# Altium schematic sheet inputVac.SchDoc
size 381 x 241 mm
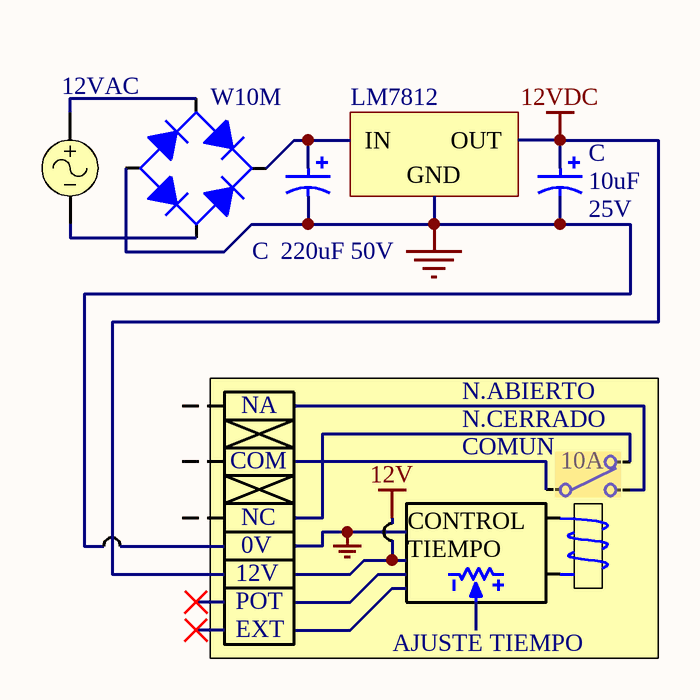
[diagram p0: inputVac.SchDoc]

## Parts
(Parts that share a designator on the sheet are numbered #1, #2 ... from top to bottom, then left to right.)
C#1  value 220uF  Voltaje: 50V  [C_EL_6-3X11]  (hidden comment: Cap Pol)
C#2  value 10uF  Voltaje: 25V  [C_EL_6-3X11]  (hidden comment: Cap Pol)
K?  Relay2  [RELAY2]  (value not drawn)
R?  Set Position: AJUSTE TIEMPO  [conpol4x1]  (hidden comment: RVar)  (part A of 2)
U?  LM7812  [TO220]
V?  12VAC
W10M  W10M  [DIODE BRIDGE2]  (value not drawn)

## Nets
12VDC: C#2.1 U?.3(OUT)
GND: C#1.2 C#2.2 U?.2(GND) W10M.1(A)
NetC#1_1: C#1.1 U?.1(IN) W10M.3(K)
NetV?_1: V?.1 W10M.2(C)
NetV?_2: V?.2 W10M.4(C)

Not connected (* = marked no-connect by the designer): K? 1 2 3 4 5; R? 1 2 3

## Notes on the sheet
- COM
- NA
- NC
- (near K?) N.ABIERTO
- (near K?) N.CERRADO
- (near K?) COMUN
- (near K?) 10A
- 12V
- POT
- EXT
- 0V
- (near R?) CONTROL TIEMPO

## Library data of the parts
C#1 C#2 = Cap Pol: Capacitor Polarizado; Price: ?
K? = Relay2: Relay; Price: ?; Current: ?
R? = RVar: Resistencia Variable; Value: 1K
U? = LM7812: Codigo Elemon: CI270LIN007812S; Dolares Elemon: 0.33880
V? = VSIN: Sinusoidal Voltage Source; Note: PCB Footprint - Not required; Published: 8-Jun-2000; LatestRevisionDate: 15-Nov-2004; LatestRevisionNote: Corrected Netlist.; PackageReference: Not Applicable; Publisher: Altium Limited
W10M = W10M: Codigo Elemon: DI1252030; Dolares Elemon: 0.23651